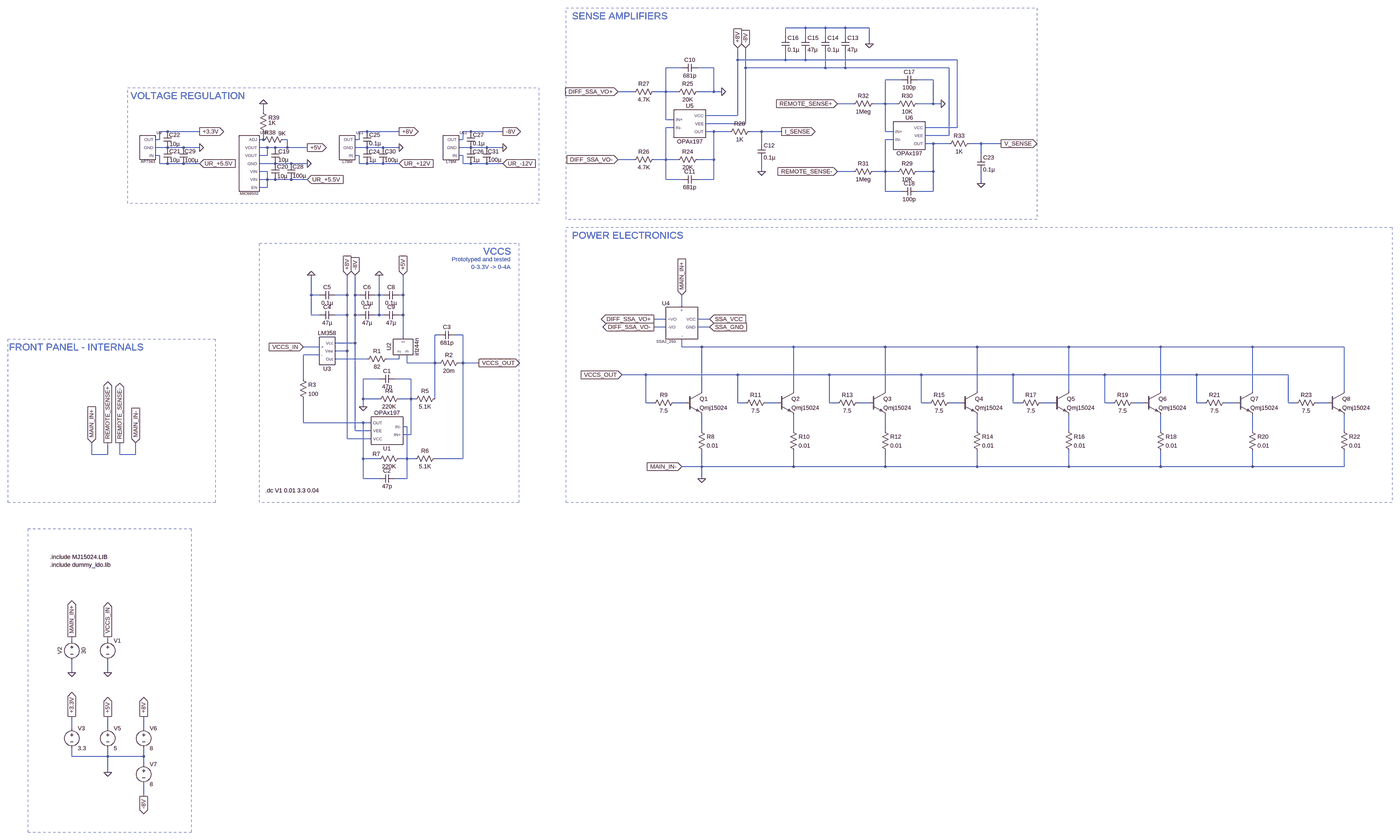
[diagram p0: schematic PDCL V1.asc, whole sheet]
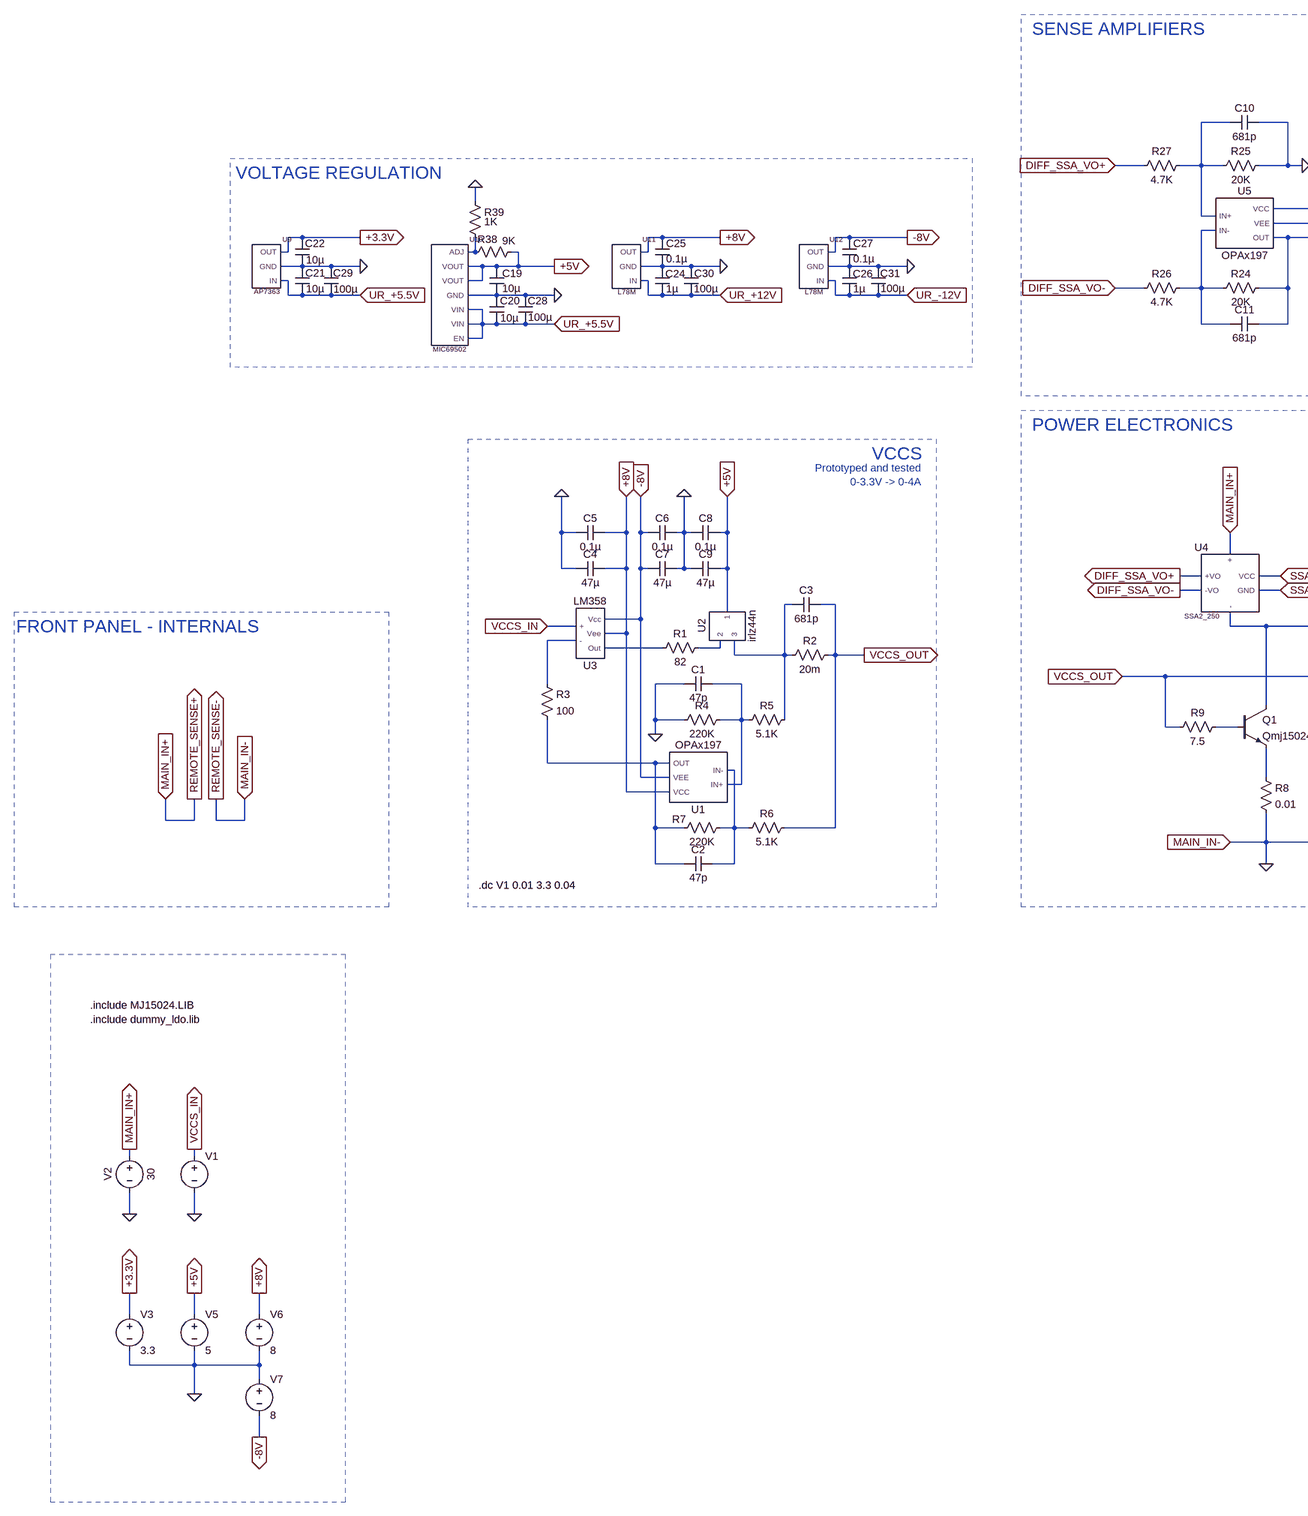
[diagram p1: schematic PDCL V1.asc, part, row 1 of 1, column 1 of 2]
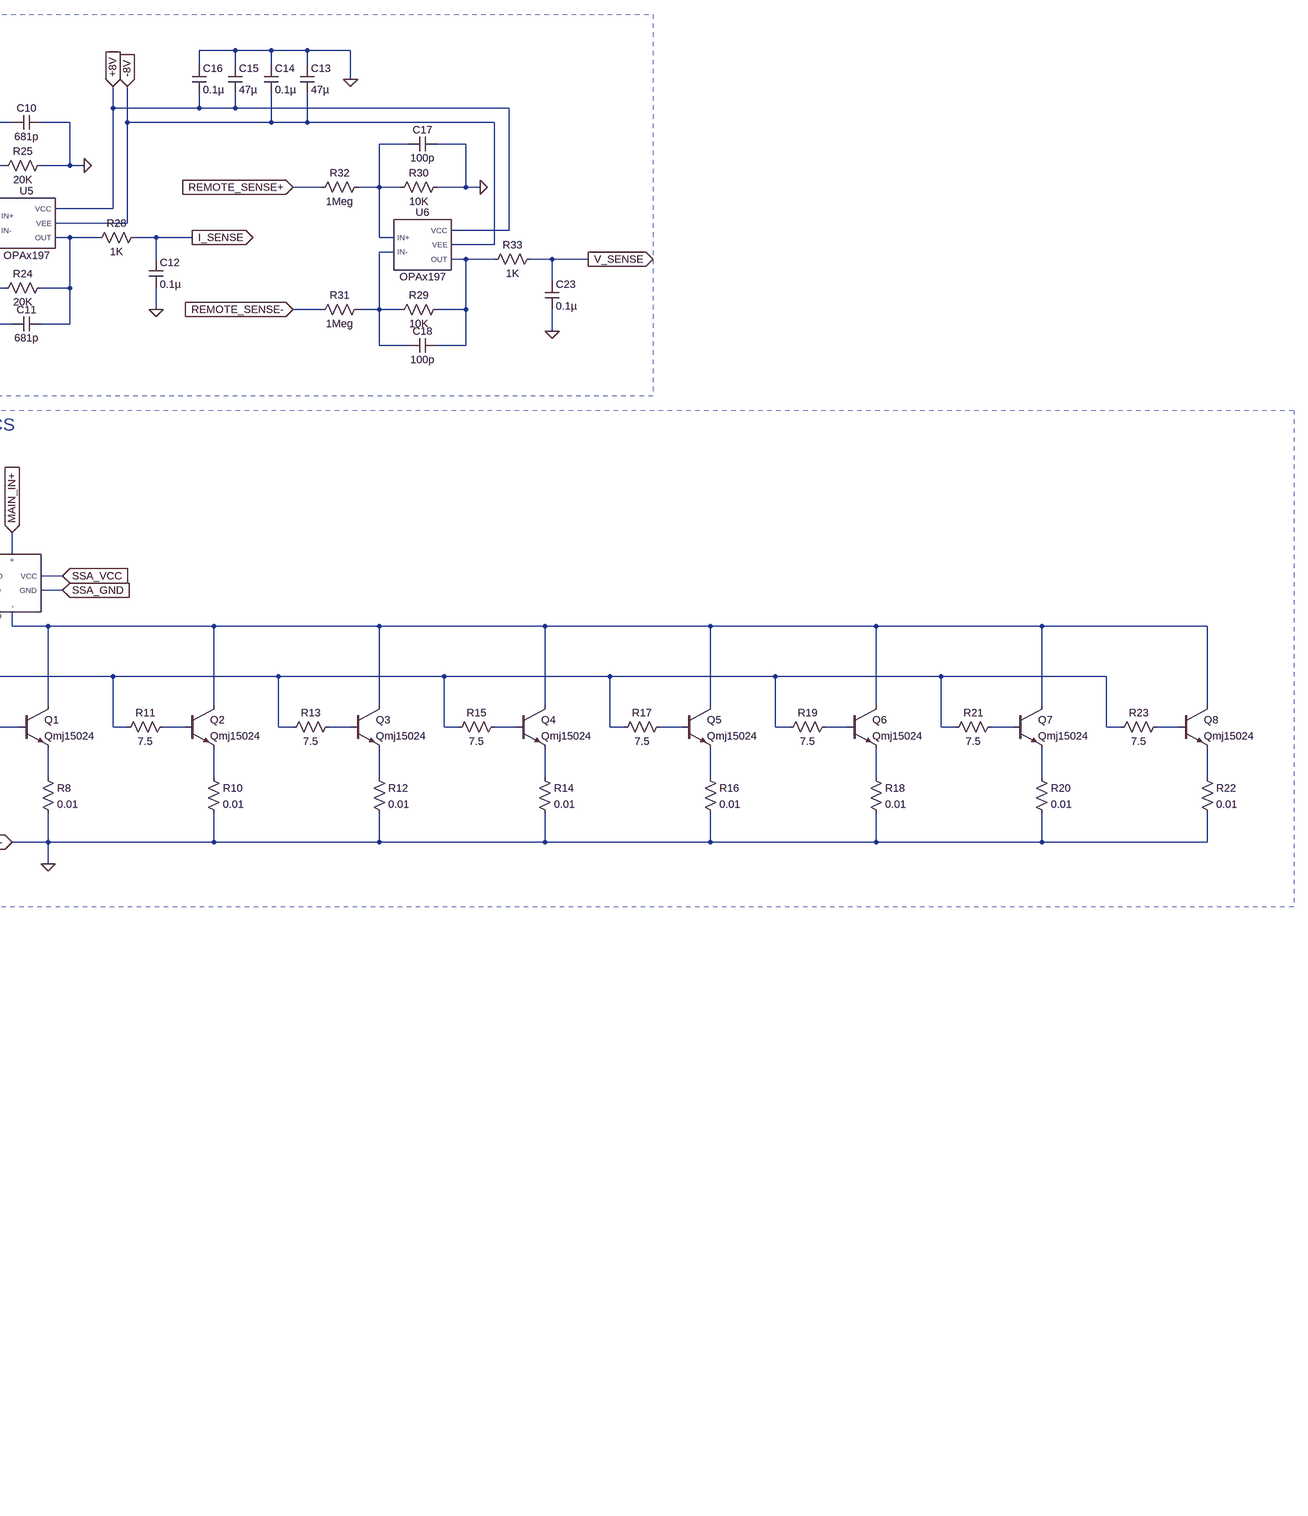
[diagram p2: schematic PDCL V1.asc, part, row 1 of 1, column 2 of 2]
PDCL V1.asc, the LTspice schematic file:
Version 4.1
SHEET 1 4852 2484
WIRE 2288 -1008 2208 -1008
WIRE 2368 -1008 2288 -1008
WIRE 2448 -1008 2368 -1008
WIRE 2544 -1008 2448 -1008
WIRE 2208 -976 2208 -1008
WIRE 2288 -976 2288 -1008
WIRE 2368 -976 2368 -1008
WIRE 2448 -976 2448 -1008
WIRE 2544 -944 2544 -1008
WIRE 2016 -880 2016 -928
WIRE 2208 -880 2208 -912
WIRE 2208 -880 2016 -880
WIRE 2288 -880 2288 -912
WIRE 2288 -880 2208 -880
WIRE 2896 -880 2288 -880
WIRE 1792 -848 1728 -848
WIRE 1920 -848 1856 -848
WIRE 2048 -848 2048 -928
WIRE 2368 -848 2368 -912
WIRE 2368 -848 2048 -848
WIRE 2448 -848 2448 -912
WIRE 2448 -848 2368 -848
WIRE 2864 -848 2448 -848
WIRE 2672 -800 2608 -800
WIRE 2800 -800 2736 -800
WIRE 1600 -752 1536 -752
WIRE 1728 -752 1728 -848
WIRE 1728 -752 1680 -752
WIRE 1776 -752 1728 -752
WIRE 1920 -752 1920 -848
WIRE 1920 -752 1856 -752
WIRE 1952 -752 1920 -752
WIRE 2480 -704 2416 -704
WIRE 2608 -704 2608 -800
WIRE 2608 -704 2560 -704
WIRE 2656 -704 2608 -704
WIRE 2800 -704 2800 -800
WIRE 2800 -704 2736 -704
WIRE 2832 -704 2800 -704
WIRE 96 -672 96 -704
WIRE 2016 -656 2016 -880
WIRE 2016 -656 1888 -656
WIRE 1728 -640 1728 -752
WIRE 1760 -640 1728 -640
WIRE 2048 -624 2048 -848
WIRE 2048 -624 1888 -624
WIRE 1760 -608 1728 -608
WIRE 2896 -608 2896 -880
WIRE 2896 -608 2768 -608
WIRE -288 -592 -320 -592
WIRE -160 -592 -288 -592
WIRE 512 -592 480 -592
WIRE 640 -592 512 -592
WIRE 928 -592 896 -592
WIRE 1056 -592 928 -592
WIRE 1920 -592 1888 -592
WIRE 1984 -592 1920 -592
WIRE 2112 -592 2064 -592
WIRE 2192 -592 2112 -592
WIRE 2608 -592 2608 -704
WIRE 2640 -592 2608 -592
WIRE 2864 -576 2864 -848
WIRE 2864 -576 2768 -576
WIRE -320 -560 -320 -592
WIRE -320 -560 -336 -560
WIRE 96 -560 96 -592
WIRE 96 -560 80 -560
WIRE 192 -560 176 -560
WIRE 480 -560 480 -592
WIRE 480 -560 464 -560
WIRE 896 -560 896 -592
WIRE 896 -560 880 -560
WIRE 2640 -560 2608 -560
WIRE 2112 -544 2112 -592
WIRE 2800 -544 2768 -544
WIRE 2864 -544 2800 -544
WIRE 2992 -544 2944 -544
WIRE 3072 -544 2992 -544
WIRE -288 -528 -336 -528
WIRE -224 -528 -288 -528
WIRE -160 -528 -224 -528
WIRE 112 -528 80 -528
WIRE 144 -528 112 -528
WIRE 192 -528 192 -560
WIRE 192 -528 144 -528
WIRE 272 -528 192 -528
WIRE 512 -528 464 -528
WIRE 576 -528 512 -528
WIRE 640 -528 576 -528
WIRE 928 -528 880 -528
WIRE 992 -528 928 -528
WIRE 1056 -528 992 -528
WIRE -320 -496 -336 -496
WIRE 112 -496 112 -528
WIRE 112 -496 80 -496
WIRE 480 -496 464 -496
WIRE 896 -496 880 -496
WIRE 2992 -496 2992 -544
WIRE 1600 -480 1536 -480
WIRE 1728 -480 1728 -608
WIRE 1728 -480 1680 -480
WIRE 1776 -480 1728 -480
WIRE 1920 -480 1920 -592
WIRE 1920 -480 1856 -480
WIRE -320 -464 -320 -496
WIRE -288 -464 -320 -464
WIRE -224 -464 -288 -464
WIRE -160 -464 -224 -464
WIRE 144 -464 80 -464
WIRE 208 -464 144 -464
WIRE 272 -464 208 -464
WIRE 480 -464 480 -496
WIRE 512 -464 480 -464
WIRE 576 -464 512 -464
WIRE 640 -464 576 -464
WIRE 896 -464 896 -496
WIRE 928 -464 896 -464
WIRE 992 -464 928 -464
WIRE 1056 -464 992 -464
WIRE 112 -432 80 -432
WIRE 2112 -432 2112 -480
WIRE 2480 -432 2416 -432
WIRE 2608 -432 2608 -560
WIRE 2608 -432 2560 -432
WIRE 2656 -432 2608 -432
WIRE 2800 -432 2800 -544
WIRE 2800 -432 2736 -432
WIRE 112 -400 112 -432
WIRE 112 -400 80 -400
WIRE 144 -400 112 -400
WIRE 208 -400 144 -400
WIRE 272 -400 208 -400
WIRE 1728 -400 1728 -480
WIRE 1792 -400 1728 -400
WIRE 1920 -400 1920 -480
WIRE 1920 -400 1856 -400
WIRE 2992 -384 2992 -432
WIRE 112 -368 112 -400
WIRE 112 -368 80 -368
WIRE 2608 -352 2608 -432
WIRE 2672 -352 2608 -352
WIRE 2800 -352 2800 -432
WIRE 2800 -352 2736 -352
WIRE 288 64 288 -16
WIRE 320 64 288 64
WIRE 432 64 432 -16
WIRE 432 64 384 64
WIRE 464 64 464 -16
WIRE 480 64 464 64
WIRE 560 64 560 -16
WIRE 560 64 544 64
WIRE 576 64 560 64
WIRE 656 64 656 -16
WIRE 656 64 640 64
WIRE 1792 112 1792 64
WIRE 288 144 288 64
WIRE 320 144 288 144
WIRE 432 144 432 64
WIRE 432 144 384 144
WIRE 464 144 464 64
WIRE 480 144 464 144
WIRE 560 144 560 64
WIRE 560 144 544 144
WIRE 576 144 560 144
WIRE 656 144 656 64
WIRE 656 144 640 144
WIRE 1728 160 1680 160
WIRE 1904 160 1856 160
WIRE 1728 192 1680 192
WIRE 1904 192 1856 192
WIRE 800 224 784 224
WIRE 896 224 864 224
WIRE 656 240 656 144
WIRE 464 256 464 144
WIRE 464 256 384 256
WIRE 320 272 256 272
WIRE 1792 272 1792 240
WIRE 1872 272 1792 272
WIRE 2240 272 1872 272
WIRE 2608 272 2240 272
WIRE 2976 272 2608 272
WIRE 3344 272 2976 272
WIRE 3712 272 3344 272
WIRE 4080 272 3712 272
WIRE 4448 272 4080 272
WIRE 432 288 432 144
WIRE 432 288 384 288
WIRE 320 304 256 304
WIRE 512 320 384 320
WIRE 640 320 640 304
WIRE 640 320 592 320
WIRE 672 336 672 304
WIRE 784 336 784 224
WIRE 784 336 672 336
WIRE 800 336 784 336
WIRE 896 336 896 224
WIRE 896 336 880 336
WIRE 960 336 896 336
WIRE 1648 384 1552 384
WIRE 2016 384 1648 384
WIRE 2384 384 2016 384
WIRE 2752 384 2384 384
WIRE 3120 384 2752 384
WIRE 3488 384 3120 384
WIRE 3856 384 3488 384
WIRE 4224 384 3856 384
WIRE 256 400 256 304
WIRE 560 400 496 400
WIRE 688 400 624 400
WIRE 1872 448 1872 272
WIRE 2240 448 2240 272
WIRE 2608 448 2608 272
WIRE 2976 448 2976 272
WIRE 3344 448 3344 272
WIRE 3712 448 3712 272
WIRE 4080 448 4080 272
WIRE 4448 448 4448 272
WIRE 496 480 496 400
WIRE 560 480 496 480
WIRE 688 480 688 400
WIRE 688 480 640 480
WIRE 704 480 688 480
WIRE 784 480 784 336
WIRE 1648 496 1648 384
WIRE 1680 496 1648 496
WIRE 1808 496 1760 496
WIRE 2016 496 2016 384
WIRE 2048 496 2016 496
WIRE 2176 496 2128 496
WIRE 2384 496 2384 384
WIRE 2416 496 2384 496
WIRE 2544 496 2496 496
WIRE 2752 496 2752 384
WIRE 2784 496 2752 496
WIRE 2912 496 2864 496
WIRE 3120 496 3120 384
WIRE 3152 496 3120 496
WIRE 3280 496 3232 496
WIRE 3488 496 3488 384
WIRE 3520 496 3488 496
WIRE 3648 496 3600 496
WIRE 3856 496 3856 384
WIRE 3888 496 3856 496
WIRE 4016 496 3968 496
WIRE 4224 496 4224 384
WIRE 4256 496 4224 496
WIRE 4384 496 4336 496
WIRE 496 512 496 480
WIRE 256 576 256 480
WIRE 496 576 256 576
WIRE 528 576 496 576
WIRE 672 592 656 592
WIRE 464 608 464 256
WIRE 528 608 464 608
WIRE 1872 608 1872 544
WIRE 2240 608 2240 544
WIRE 2608 608 2608 544
WIRE 2976 608 2976 544
WIRE 3344 608 3344 544
WIRE 3712 608 3712 544
WIRE 4080 608 4080 544
WIRE 4448 608 4448 544
WIRE 688 624 688 480
WIRE 688 624 656 624
WIRE 432 640 432 288
WIRE 528 640 432 640
WIRE -592 704 -592 656
WIRE -528 704 -528 656
WIRE -528 704 -592 704
WIRE -480 704 -480 656
WIRE -416 704 -416 656
WIRE -416 704 -480 704
WIRE 496 720 496 576
WIRE 560 720 496 720
WIRE 672 720 672 592
WIRE 672 720 640 720
WIRE 704 720 672 720
WIRE 896 720 896 336
WIRE 896 720 784 720
WIRE 1872 752 1872 688
WIRE 1872 752 1792 752
WIRE 2240 752 2240 688
WIRE 2240 752 1872 752
WIRE 2608 752 2608 688
WIRE 2608 752 2240 752
WIRE 2976 752 2976 688
WIRE 2976 752 2608 752
WIRE 3344 752 3344 688
WIRE 3344 752 2976 752
WIRE 3712 752 3712 688
WIRE 3712 752 3344 752
WIRE 4080 752 4080 688
WIRE 4080 752 3712 752
WIRE 4448 752 4448 688
WIRE 4448 752 4080 752
WIRE 496 800 496 720
WIRE 560 800 496 800
WIRE 672 800 672 720
WIRE 672 800 624 800
WIRE 1872 800 1872 752
WIRE -672 1712 -672 1696
WIRE -528 1712 -528 1696
WIRE -672 1840 -672 1792
WIRE -528 1840 -528 1792
WIRE -672 2064 -672 2016
WIRE -528 2064 -528 2016
WIRE -384 2064 -384 2016
WIRE -672 2176 -672 2144
WIRE -528 2176 -528 2144
WIRE -528 2176 -672 2176
WIRE -384 2176 -384 2144
WIRE -384 2176 -528 2176
WIRE -384 2208 -384 2176
WIRE -528 2240 -528 2176
WIRE -384 2336 -384 2288
FLAG 496 512 0
FLAG -528 1840 0
FLAG -528 2240 0
FLAG -528 2016 +5V
IOPIN -528 2016 Out
FLAG 656 -16 +5V
IOPIN 656 -16 In
FLAG -384 2016 +8V
IOPIN -384 2016 Out
FLAG -384 2336 -8V
IOPIN -384 2336 Out
FLAG 432 -16 +8V
IOPIN 432 -16 In
FLAG 464 -16 -8V
IOPIN 464 -16 In
FLAG 560 -16 0
FLAG 1552 384 VCCS_OUT
IOPIN 1552 384 In
FLAG 960 336 VCCS_OUT
IOPIN 960 336 Out
FLAG 1792 752 MAIN_IN-
IOPIN 1792 752 In
FLAG -672 1840 0
FLAG 288 -16 0
FLAG 1792 64 MAIN_IN+
IOPIN 1792 64 In
FLAG 1872 800 0
FLAG 1904 192 SSA_GND
IOPIN 1904 192 In
FLAG 1904 160 SSA_VCC
IOPIN 1904 160 In
FLAG 1680 160 DIFF_SSA_VO+
IOPIN 1680 160 Out
FLAG 1680 192 DIFF_SSA_VO-
IOPIN 1680 192 Out
FLAG -672 1696 MAIN_IN+
IOPIN -672 1696 Out
FLAG 1952 -752 0
FLAG 2112 -432 0
FLAG 1536 -752 DIFF_SSA_VO+
IOPIN 1536 -752 In
FLAG 1536 -480 DIFF_SSA_VO-
IOPIN 1536 -480 In
FLAG 2192 -592 I_SENSE
IOPIN 2192 -592 Out
FLAG 2832 -704 0
FLAG 2016 -928 +8V
IOPIN 2016 -928 In
FLAG 2048 -928 -8V
IOPIN 2048 -928 In
FLAG 2992 -384 0
FLAG 3072 -544 V_SENSE
IOPIN 3072 -544 Out
FLAG -592 656 MAIN_IN+
IOPIN -592 656 In
FLAG -528 656 REMOTE_SENSE+
IOPIN -528 656 Out
FLAG -480 656 REMOTE_SENSE-
IOPIN -480 656 Out
FLAG -416 656 MAIN_IN-
IOPIN -416 656 In
FLAG 2544 -944 0
FLAG -160 -592 +3.3V
IOPIN -160 -592 Out
FLAG 272 -528 +5V
IOPIN 272 -528 Out
FLAG -160 -464 UR_+5.5V
IOPIN -160 -464 In
FLAG 272 -400 UR_+5.5V
IOPIN 272 -400 In
FLAG 640 -464 UR_+12V
IOPIN 640 -464 In
FLAG 640 -592 +8V
IOPIN 640 -592 Out
FLAG 96 -704 0
FLAG 272 -464 0
FLAG -160 -528 0
FLAG 640 -528 0
FLAG 1056 -464 UR_-12V
IOPIN 1056 -464 In
FLAG 1056 -592 -8V
IOPIN 1056 -592 Out
FLAG 1056 -528 0
FLAG -672 2016 +3.3V
IOPIN -672 2016 Out
FLAG 2416 -704 REMOTE_SENSE+
IOPIN 2416 -704 In
FLAG 2416 -432 REMOTE_SENSE-
IOPIN 2416 -432 In
FLAG 256 272 VCCS_IN
IOPIN 256 272 In
FLAG -528 1696 VCCS_IN
IOPIN -528 1696 Out
SYMBOL res 896 320 R90
WINDOW 0 0 56 VBottom 2
WINDOW 3 32 56 VTop 2
SYMATTR InstName R2
SYMATTR Value 20m
SYMATTR SpiceLine tol=1 pwr=1 mfg="Vishay " pn="WSL2010R0200FEA18"
SYMBOL res 656 464 R90
WINDOW 0 0 56 VBottom 2
WINDOW 3 32 56 VTop 2
SYMATTR InstName R4
SYMATTR Value 220K
SYMATTR SpiceLine tol=0.1 pwr=0.125 mfg="Yageo" pn="RT0805BRD07220KL"
SYMBOL res 800 464 R90
WINDOW 0 0 56 VBottom 2
WINDOW 3 32 56 VTop 2
SYMATTR InstName R5
SYMATTR Value 5.1K
SYMATTR SpiceLine tol=0.1 pwr=0.1 mfg="Yageo" pn="RT0603BRD075K1L"
SYMBOL res 800 704 R90
WINDOW 0 0 56 VBottom 2
WINDOW 3 32 56 VTop 2
SYMATTR InstName R6
SYMATTR Value 5.1K
SYMATTR SpiceLine tol=0.1 pwr=0.1 mfg="Yageo" pn="RT0603BRD075K1L"
SYMBOL res 656 704 R90
WINDOW 0 13 107 VBottom 2
WINDOW 3 32 56 VTop 2
SYMATTR InstName R7
SYMATTR Value 220K
SYMATTR SpiceLine tol=0.1 pwr=0.125 mfg="Yageo" pn="RT0805BRD07220KL"
SYMBOL voltage -528 1696 R0
WINDOW 123 0 0 Left 0
WINDOW 39 0 0 Left 0
SYMATTR InstName V1
SYMATTR Value ""
SYMBOL voltage -528 2048 R0
WINDOW 123 0 0 Left 0
WINDOW 39 0 0 Left 0
SYMATTR InstName V5
SYMATTR Value 5
SYMBOL voltage -384 2048 R0
WINDOW 123 0 0 Left 0
WINDOW 39 0 0 Left 0
SYMATTR InstName V6
SYMATTR Value 8
SYMBOL voltage -384 2192 R0
WINDOW 123 0 0 Left 0
WINDOW 39 0 0 Left 0
SYMATTR InstName V7
SYMATTR Value 8
SYMBOL irlz44n 656 272 M90
SYMATTR InstName U2
SYMBOL OPAx197 592 608 R180
SYMATTR InstName U1
SYMBOL res 608 304 R90
WINDOW 0 0 56 VBottom 2
WINDOW 3 32 56 VTop 2
SYMATTR InstName R1
SYMATTR Value 82
SYMBOL cap 624 384 R90
WINDOW 0 0 32 VBottom 2
WINDOW 3 32 32 VTop 2
SYMATTR InstName C1
SYMATTR Value 47p
SYMATTR SpiceLine V=50 Irms=0 Rser=0 Lser=0 mfg="Murata" pn="GRM0335C1H470JA01" type="C0G"
SYMBOL cap 624 784 R90
WINDOW 0 0 32 VBottom 2
WINDOW 3 32 32 VTop 2
SYMATTR InstName C2
SYMATTR Value 47p
SYMATTR SpiceLine V=50 Irms=0 Rser=0 Lser=0 mfg="Murata" pn="GRM0335C1H470JA01" type="C0G"
SYMBOL cap 864 208 R90
WINDOW 0 0 32 VBottom 2
WINDOW 3 32 32 VTop 2
SYMATTR InstName C3
SYMATTR Value 681p
SYMATTR SpiceLine V=50 Irms=0 Rser=0.002 Lser=800p mfg="Murata" pn="GRM0335C1H681JE01D" type="C0G/NP0"
SYMBOL cap 384 128 R90
WINDOW 0 0 32 VBottom 2
WINDOW 3 32 32 VTop 2
SYMATTR InstName C4
SYMATTR Value 47µ
SYMATTR SpiceLine V=25 Irms=0 Rser=0 Lser=0 mfg="KEMET" pn="ESH476M025AC3AA" type="ESH"
SYMBOL cap 384 48 R90
WINDOW 0 0 32 VBottom 2
WINDOW 3 32 32 VTop 2
SYMATTR InstName C5
SYMATTR Value 0.1µ
SYMATTR SpiceLine V=50 Irms=0 Rser=0.01 Lser=1000p mfg="Samsung Electro-Mechanics" pn="CL10B104KB8NNNC" type="X7R"
SYMBOL cap 544 48 R90
WINDOW 0 0 32 VBottom 2
WINDOW 3 32 32 VTop 2
SYMATTR InstName C6
SYMATTR Value 0.1µ
SYMATTR SpiceLine V=50 Irms=0 Rser=0.01 Lser=1000p mfg="Samsung Electro-Mechanics" pn="CL10B104KB8NNNC" type="X7R"
SYMBOL cap 544 128 R90
WINDOW 0 0 32 VBottom 2
WINDOW 3 32 32 VTop 2
SYMATTR InstName C7
SYMATTR Value 47µ
SYMATTR SpiceLine V=25 Irms=0 Rser=0 Lser=0 mfg="KEMET" pn="ESH476M025AC3AA" type="ESH"
SYMBOL cap 640 48 R90
WINDOW 0 0 32 VBottom 2
WINDOW 3 32 32 VTop 2
SYMATTR InstName C8
SYMATTR Value 0.1µ
SYMATTR SpiceLine V=50 Irms=0 Rser=0.01 Lser=1000p mfg="Samsung Electro-Mechanics" pn="CL10B104KB8NNNC" type="X7R"
SYMBOL cap 640 128 R90
WINDOW 0 0 32 VBottom 2
WINDOW 3 32 32 VTop 2
SYMATTR InstName C9
SYMATTR Value 47µ
SYMATTR SpiceLine V=25 Irms=0 Rser=0 Lser=0 mfg="KEMET" pn="ESH476M025AC3AA" type="ESH"
SYMBOL res 240 384 R0
SYMATTR InstName R3
SYMATTR Value 100
SYMATTR SpiceLine tol=1 pwr=0.1 mfg="Yageo" pn="RC0603FR-07100RL"
SYMBOL LM358 352 288 M180
SYMATTR InstName U3
SYMBOL npn 1808 448 R0
SYMATTR InstName Q1
SYMATTR Value Qmj15024
SYMBOL res 1856 592 R0
SYMATTR InstName R8
SYMATTR Value 0.01
SYMBOL voltage -672 1696 R0
WINDOW 0 -32 56 VBottom 2
WINDOW 3 32 56 VTop 2
WINDOW 123 0 0 Left 0
WINDOW 39 0 0 Left 0
SYMATTR InstName V2
SYMATTR Value 30
SYMBOL res 1776 480 R90
WINDOW 0 0 56 VBottom 2
WINDOW 3 32 56 VTop 2
SYMATTR InstName R9
SYMATTR Value 7.5
SYMBOL npn 2176 448 R0
SYMATTR InstName Q2
SYMATTR Value Qmj15024
SYMBOL res 2224 592 R0
SYMATTR InstName R10
SYMATTR Value 0.01
SYMBOL res 2144 480 R90
WINDOW 0 0 56 VBottom 2
WINDOW 3 32 56 VTop 2
SYMATTR InstName R11
SYMATTR Value 7.5
SYMBOL npn 2544 448 R0
SYMATTR InstName Q3
SYMATTR Value Qmj15024
SYMBOL res 2592 592 R0
SYMATTR InstName R12
SYMATTR Value 0.01
SYMBOL res 2512 480 R90
WINDOW 0 0 56 VBottom 2
WINDOW 3 32 56 VTop 2
SYMATTR InstName R13
SYMATTR Value 7.5
SYMBOL npn 2912 448 R0
SYMATTR InstName Q4
SYMATTR Value Qmj15024
SYMBOL res 2960 592 R0
SYMATTR InstName R14
SYMATTR Value 0.01
SYMBOL res 2880 480 R90
WINDOW 0 0 56 VBottom 2
WINDOW 3 32 56 VTop 2
SYMATTR InstName R15
SYMATTR Value 7.5
SYMBOL npn 3280 448 R0
SYMATTR InstName Q5
SYMATTR Value Qmj15024
SYMBOL res 3328 592 R0
SYMATTR InstName R16
SYMATTR Value 0.01
SYMBOL res 3248 480 R90
WINDOW 0 0 56 VBottom 2
WINDOW 3 32 56 VTop 2
SYMATTR InstName R17
SYMATTR Value 7.5
SYMBOL npn 3648 448 R0
SYMATTR InstName Q6
SYMATTR Value Qmj15024
SYMBOL res 3696 592 R0
SYMATTR InstName R18
SYMATTR Value 0.01
SYMBOL res 3616 480 R90
WINDOW 0 0 56 VBottom 2
WINDOW 3 32 56 VTop 2
SYMATTR InstName R19
SYMATTR Value 7.5
SYMBOL npn 4016 448 R0
SYMATTR InstName Q7
SYMATTR Value Qmj15024
SYMBOL res 4064 592 R0
SYMATTR InstName R20
SYMATTR Value 0.01
SYMBOL res 3984 480 R90
WINDOW 0 0 56 VBottom 2
WINDOW 3 32 56 VTop 2
SYMATTR InstName R21
SYMATTR Value 7.5
SYMBOL npn 4384 448 R0
SYMATTR InstName Q8
SYMATTR Value Qmj15024
SYMBOL res 4432 592 R0
SYMATTR InstName R22
SYMATTR Value 0.01
SYMBOL res 4352 480 R90
WINDOW 0 0 56 VBottom 2
WINDOW 3 32 56 VTop 2
SYMATTR InstName R23
SYMATTR Value 7.5
SYMBOL SSA2_250 1776 192 R0
SYMATTR InstName U4
SYMBOL OPAx197 1824 -624 R0
SYMATTR InstName U5
SYMBOL res 1872 -496 R90
WINDOW 0 0 56 VBottom 2
WINDOW 3 32 56 VTop 2
SYMATTR InstName R24
SYMATTR Value 20K
SYMATTR SpiceLine tol=1 pwr=0.063 mfg="Yageo" pn="RC0402FR-0720KL"
SYMBOL res 1872 -768 R90
WINDOW 0 0 56 VBottom 2
WINDOW 3 32 56 VTop 2
SYMATTR InstName R25
SYMATTR Value 20K
SYMATTR SpiceLine tol=1 pwr=0.063 mfg="Yageo" pn="RC0402FR-0720KL"
SYMBOL res 1696 -496 R90
WINDOW 0 0 56 VBottom 2
WINDOW 3 32 56 VTop 2
SYMATTR InstName R26
SYMATTR Value 4.7K
SYMATTR SpiceLine tol=1 pwr=0.1 mfg="Yageo" pn="RC0603FR-074K7L"
SYMBOL res 1696 -768 R90
WINDOW 0 0 56 VBottom 2
WINDOW 3 32 56 VTop 2
SYMATTR InstName R27
SYMATTR Value 4.7K
SYMATTR SpiceLine tol=1 pwr=0.1 mfg="Yageo" pn="RC0603FR-074K7L"
SYMBOL cap 1856 -864 R90
WINDOW 0 0 32 VBottom 2
WINDOW 3 32 32 VTop 2
SYMATTR InstName C10
SYMATTR Value 681p
SYMATTR SpiceLine V=50 Irms=0 Rser=0.002 Lser=800p mfg="Murata" pn="GRM0335C1H681JE01D" type="C0G/NP0"
SYMBOL cap 1856 -416 R90
WINDOW 0 0 32 VBottom 2
WINDOW 3 32 32 VTop 2
SYMATTR InstName C11
SYMATTR Value 681p
SYMATTR SpiceLine V=50 Irms=0 Rser=0.002 Lser=800p mfg="Murata" pn="GRM0335C1H681JE01D" type="C0G/NP0"
SYMBOL res 2080 -608 R90
WINDOW 0 0 56 VBottom 2
WINDOW 3 32 56 VTop 2
SYMATTR InstName R28
SYMATTR Value 1K
SYMATTR SpiceLine tol=1 pwr=0.1 mfg="Yageo" pn="RC0603FR-071KL"
SYMBOL cap 2096 -544 R0
SYMATTR InstName C12
SYMATTR Value 0.1µ
SYMATTR SpiceLine V=50 Irms=0 Rser=0.01 Lser=1000p mfg="Samsung Electro-Mechanics" pn="CL10B104KB8NNNC" type="X7R"
SYMBOL OPAx197 2704 -576 R0
SYMATTR InstName U6
SYMBOL res 2752 -448 R90
WINDOW 0 0 56 VBottom 2
WINDOW 3 32 56 VTop 2
SYMATTR InstName R29
SYMATTR Value 10K
SYMATTR SpiceLine tol=0.5 pwr=0.125 mfg="Stackpole Electronics" pn="RNCF0805DTC10K0"
SYMBOL res 2752 -720 R90
WINDOW 0 0 56 VBottom 2
WINDOW 3 32 56 VTop 2
SYMATTR InstName R30
SYMATTR Value 10K
SYMATTR SpiceLine tol=0.5 pwr=0.125 mfg="Stackpole Electronics" pn="RNCF0805DTC10K0"
SYMBOL res 2576 -448 R90
WINDOW 0 0 56 VBottom 2
WINDOW 3 32 56 VTop 2
SYMATTR InstName R31
SYMATTR Value 1Meg
SYMATTR SpiceLine tol=1 pwr=0.1 mfg="Yageo" pn="RC0603FR-071ML"
SYMBOL res 2576 -720 R90
WINDOW 0 0 56 VBottom 2
WINDOW 3 32 56 VTop 2
SYMATTR InstName R32
SYMATTR Value 1Meg
SYMATTR SpiceLine tol=1 pwr=0.1 mfg="Yageo" pn="RC0603FR-071ML"
SYMBOL cap 2736 -816 R90
WINDOW 0 0 32 VBottom 2
WINDOW 3 32 32 VTop 2
SYMATTR InstName C17
SYMATTR Value 100p
SYMATTR SpiceLine V=50 Irms=0 Rser=0.1 Lser=500p mfg="Samsung Electro-Mechanics" pn="CL05C101JB5NNNC" type="C0G/NP0"
SYMBOL cap 2736 -368 R90
WINDOW 0 0 32 VBottom 2
WINDOW 3 32 32 VTop 2
SYMATTR InstName C18
SYMATTR Value 100p
SYMATTR SpiceLine V=50 Irms=0 Rser=0.1 Lser=500p mfg="Samsung Electro-Mechanics" pn="CL05C101JB5NNNC" type="C0G/NP0"
SYMBOL cap 2976 -496 R0
SYMATTR InstName C23
SYMATTR Value 0.1µ
SYMATTR SpiceLine V=50 Irms=0 Rser=0.01 Lser=1000p mfg="Samsung Electro-Mechanics" pn="CL10B104KB8NNNC" type="X7R"
SYMBOL res 2960 -560 R90
WINDOW 0 0 56 VBottom 2
WINDOW 3 32 56 VTop 2
SYMATTR InstName R33
SYMATTR Value 1K
SYMATTR SpiceLine tol=1 pwr=0.1 mfg="Yageo" pn="RC0603FR-071KL"
SYMBOL cap 2432 -976 R0
SYMATTR InstName C13
SYMATTR Value 47µ
SYMATTR SpiceLine V=25 Irms=0 Rser=0 Lser=0 mfg="KEMET" pn="ESH476M025AC3AA" type="ESH"
SYMBOL cap 2352 -976 R0
SYMATTR InstName C14
SYMATTR Value 0.1µ
SYMATTR SpiceLine V=50 Irms=0 Rser=0.01 Lser=1000p mfg="Samsung Electro-Mechanics" pn="CL10B104KB8NNNC" type="X7R"
SYMBOL cap 2272 -976 R0
SYMATTR InstName C15
SYMATTR Value 47µ
SYMATTR SpiceLine V=25 Irms=0 Rser=0 Lser=0 mfg="KEMET" pn="ESH476M025AC3AA" type="ESH"
SYMBOL cap 2192 -976 R0
SYMATTR InstName C16
SYMATTR Value 0.1µ
SYMATTR SpiceLine V=50 Irms=0 Rser=0.01 Lser=1000p mfg="Samsung Electro-Mechanics" pn="CL10B104KB8NNNC" type="X7R"
SYMBOL AP7363 -368 -512 R0
SYMATTR InstName U9
SYMBOL MIC69502 48 -432 R0
SYMATTR InstName U10
SYMBOL L78M 432 -496 R0
SYMATTR InstName U11
SYMBOL res 192 -576 R90
WINDOW 0 4 69 VBottom 2
WINDOW 3 -24 21 VTop 2
SYMATTR InstName R38
SYMATTR Value 9K
SYMBOL res 80 -688 R0
WINDOW 3 36 61 Left 2
SYMATTR Value 1K
SYMATTR InstName R39
SYMATTR SpiceLine tol=1 pwr=0.1 mfg="Yageo" pn="RC0603FR-071KL"
SYMBOL cap 128 -528 R0
WINDOW 0 28 16 Left 2
WINDOW 3 28 49 Left 2
SYMATTR InstName C19
SYMATTR Value 10µ
SYMATTR SpiceLine V=50 Irms=0 Rser=0 Lser=500p mfg="Samsung Electro-Mechanics" pn="CL31A106MBHNNNE" type="X5R"
SYMBOL cap 128 -464 R0
WINDOW 0 23 13 Left 2
WINDOW 3 24 51 Left 2
SYMATTR InstName C20
SYMATTR Value 10µ
SYMATTR SpiceLine V=50 Irms=0 Rser=0 Lser=500p mfg="Samsung Electro-Mechanics" pn="CL31A106MBHNNNE" type="X5R"
SYMBOL cap -304 -528 R0
WINDOW 0 23 15 Left 2
WINDOW 3 24 50 Left 2
SYMATTR InstName C21
SYMATTR Value 10µ
SYMATTR SpiceLine V=50 Irms=0 Rser=0 Lser=500p mfg="Samsung Electro-Mechanics" pn="CL31A106MBHNNNE" type="X5R"
SYMBOL cap -304 -592 R0
WINDOW 0 22 13 Left 2
WINDOW 3 24 50 Left 2
SYMATTR InstName C22
SYMATTR Value 10µ
SYMATTR SpiceLine V=50 Irms=0 Rser=0 Lser=500p mfg="Samsung Electro-Mechanics" pn="CL31A106MBHNNNE" type="X5R"
SYMBOL cap 496 -528 R0
WINDOW 0 23 17 Left 2
WINDOW 3 24 50 Left 2
SYMATTR InstName C24
SYMATTR Value 1µ
SYMATTR SpiceLine V=50 Irms=0 Rser=0 Lser=0 mfg="Samsung Electro-Mechanics" pn="CL21B105KBFNNNE" type="X7R"
SYMBOL cap 496 -592 R0
WINDOW 0 24 13 Left 2
WINDOW 3 24 47 Left 2
SYMATTR InstName C25
SYMATTR Value 0.1µ
SYMATTR SpiceLine V=50 Irms=0 Rser=0.01 Lser=1000p mfg="Samsung Electro-Mechanics" pn="CL10B104KB8NNNC" type="X7R"
SYMBOL L78M 848 -496 R0
SYMATTR InstName U12
SYMBOL cap 912 -528 R0
WINDOW 0 23 17 Left 2
WINDOW 3 24 50 Left 2
SYMATTR InstName C26
SYMATTR Value 1µ
SYMATTR SpiceLine V=50 Irms=0 Rser=0 Lser=0 mfg="Samsung Electro-Mechanics" pn="CL21B105KBFNNNE" type="X7R"
SYMBOL cap 912 -592 R0
WINDOW 0 24 13 Left 2
WINDOW 3 24 47 Left 2
SYMATTR InstName C27
SYMATTR Value 0.1µ
SYMATTR SpiceLine V=50 Irms=0 Rser=0.01 Lser=1000p mfg="Samsung Electro-Mechanics" pn="CL10B104KB8NNNC" type="X7R"
SYMBOL voltage -672 2048 R0
WINDOW 123 0 0 Left 0
WINDOW 39 0 0 Left 0
SYMATTR InstName V3
SYMATTR Value 3.3
SYMBOL cap 192 -464 R0
WINDOW 0 21 13 Left 2
WINDOW 3 22 49 Left 2
SYMATTR InstName C28
SYMATTR Value 100µ
SYMATTR SpiceLine V=25 Irms=0 Rser=0 Lser=0 mfg="KEMET" pn="ESK107M025AC3AA" type="ESK"
SYMBOL cap -240 -528 R0
WINDOW 0 20 15 Left 2
WINDOW 3 21 51 Left 2
SYMATTR InstName C29
SYMATTR Value 100µ
SYMATTR SpiceLine V=25 Irms=0 Rser=0 Lser=0 mfg="KEMET" pn="ESK107M025AC3AA" type="ESK"
SYMBOL cap 560 -528 R0
WINDOW 0 23 16 Left 2
WINDOW 3 22 50 Left 2
SYMATTR InstName C30
SYMATTR Value 100µ
SYMATTR SpiceLine V=25 Irms=0 Rser=0 Lser=0 mfg="KEMET" pn="ESK107M025AC3AA" type="ESK"
SYMBOL cap 976 -528 R0
WINDOW 0 20 16 Left 2
WINDOW 3 21 49 Left 2
SYMATTR InstName C31
SYMATTR Value 100µ
SYMATTR SpiceLine V=25 Irms=0 Rser=0 Lser=0 mfg="KEMET" pn="ESK107M025AC3AA" type="ESK"
TEXT 104 848 Left 2 !.dc V1 0.01 3.3 0.04
TEXT 1088 -112 Right 4 ;VCCS
TEXT 1088 -80 Right 2 ;Prototyped and tested\n0-3.3V -> 0-4A
TEXT -760 1376 Left 2 !.include MJ15024.LIB
TEXT 1352 -176 Left 4 ;POWER ELECTRONICS
TEXT 1352 -1056 Left 4 ;SENSE AMPLIFIERS
TEXT -760 1408 Left 2 !.include dummy_ldo.lib
TEXT -384 272 Right 4 ;FRONT PANEL - INTERNALS
TEXT 24 -736 Right 4 ;VOLTAGE REGULATION
RECTANGLE Normal 1120 896 80 -144 2
RECTANGLE Normal -848 2480 -192 1264 2
RECTANGLE Normal 4640 896 1328 -208 2
RECTANGLE Normal 3216 -240 1328 -1088 2
RECTANGLE Normal -96 896 -928 240 2
RECTANGLE Normal 1200 -304 -448 -768 2

The netlist it stands for:
* PDCL V1.asc
R2 VCCS_OUT N008 20m tol=1 pwr=1 mfg="Vishay " pn="WSL2010R0200FEA18"
R4 N013 0 220K tol=0.1 pwr=0.125 mfg="Yageo" pn="RT0805BRD07220KL"
R5 N008 N013 5.1K tol=0.1 pwr=0.1 mfg="Yageo" pn="RT0603BRD075K1L"
R6 VCCS_OUT N023 5.1K tol=0.1 pwr=0.1 mfg="Yageo" pn="RT0603BRD075K1L"
R7 N023 N022 220K tol=0.1 pwr=0.125 mfg="Yageo" pn="RT0805BRD07220KL"
V1 VCCS_IN 0
V5 +5V 0 5
V6 +8V 0 8
V7 0 -8V 8
X§U2 +5V N012 N008 irlz44n  ; pins 1 2 3
X§U1 N013 N023 +8V -8V N022 OPAx197  ; pins IN+ IN- VCC VEE OUT
R1 N012 N011 82
C1 N013 0 47p V=50 Irms=0 Rser=0 Lser=0 mfg="Murata" pn="GRM0335C1H470JA01" type="C0G"
C2 N023 N022 47p V=50 Irms=0 Rser=0 Lser=0 mfg="Murata" pn="GRM0335C1H470JA01" type="C0G"
C3 VCCS_OUT N008 681p V=50 Irms=0 Rser=0.002 Lser=800p mfg="Murata" pn="GRM0335C1H681JE01D" type="C0G/NP0"
C4 +8V 0 47µ V=25 Irms=0 Rser=0 Lser=0 mfg="KEMET" pn="ESH476M025AC3AA" type="ESH"
C5 +8V 0 0.1µ V=50 Irms=0 Rser=0.01 Lser=1000p mfg="Samsung Electro-Mechanics" pn="CL10B104KB8NNNC" type="X7R"
C6 0 -8V 0.1µ V=50 Irms=0 Rser=0.01 Lser=1000p mfg="Samsung Electro-Mechanics" pn="CL10B104KB8NNNC" type="X7R"
C7 0 -8V 47µ V=25 Irms=0 Rser=0 Lser=0 mfg="KEMET" pn="ESH476M025AC3AA" type="ESH"
C8 +5V 0 0.1µ V=50 Irms=0 Rser=0.01 Lser=1000p mfg="Samsung Electro-Mechanics" pn="CL10B104KB8NNNC" type="X7R"
C9 +5V 0 47µ V=25 Irms=0 Rser=0 Lser=0 mfg="KEMET" pn="ESH476M025AC3AA" type="ESH"
R3 N010 N022 100 tol=1 pwr=0.1 mfg="Yageo" pn="RC0603FR-07100RL"
X§U3 N010 VCCS_IN N011 +8V -8V LM358  ; pins - + Out Vee Vcc
Q1 N009 N014 N024 0 Qmj15024
R8 N024 0 0.01
V2 REMOTE_SENSE+ 0 30
R9 N014 VCCS_OUT 7.5
Q2 N009 N015 N025 0 Qmj15024
R10 N025 0 0.01
R11 N015 VCCS_OUT 7.5
Q3 N009 N016 N026 0 Qmj15024
R12 N026 0 0.01
R13 N016 VCCS_OUT 7.5
Q4 N009 N017 N027 0 Qmj15024
R14 N027 0 0.01
R15 N017 VCCS_OUT 7.5
Q5 N009 N018 N028 0 Qmj15024
R16 N028 0 0.01
R17 N018 VCCS_OUT 7.5
Q6 N009 N019 N029 0 Qmj15024
R18 N029 0 0.01
R19 N019 VCCS_OUT 7.5
Q7 N009 N020 N030 0 Qmj15024
R20 N030 0 0.01
R21 N020 VCCS_OUT 7.5
Q8 N009 N021 N031 0 Qmj15024
R22 N031 0 0.01
R23 N021 VCCS_OUT 7.5
X§U4 REMOTE_SENSE+ N009 DIFF_SSA_VO+ DIFF_SSA_VO- SSA_VCC SSA_GND SSA2_250  ; pins + - +VO -VO VCC GND
X§U5 N001 N003 +8V -8V N004 OPAx197  ; pins IN+ IN- VCC VEE OUT
R24 N004 N003 20K tol=1 pwr=0.063 mfg="Yageo" pn="RC0402FR-0720KL"
R25 0 N001 20K tol=1 pwr=0.063 mfg="Yageo" pn="RC0402FR-0720KL"
R26 N003 DIFF_SSA_VO- 4.7K tol=1 pwr=0.1 mfg="Yageo" pn="RC0603FR-074K7L"
R27 N001 DIFF_SSA_VO+ 4.7K tol=1 pwr=0.1 mfg="Yageo" pn="RC0603FR-074K7L"
C10 0 N001 681p V=50 Irms=0 Rser=0.002 Lser=800p mfg="Murata" pn="GRM0335C1H681JE01D" type="C0G/NP0"
C11 N004 N003 681p V=50 Irms=0 Rser=0.002 Lser=800p mfg="Murata" pn="GRM0335C1H681JE01D" type="C0G/NP0"
R28 I_SENSE N004 1K tol=1 pwr=0.1 mfg="Yageo" pn="RC0603FR-071KL"
C12 I_SENSE 0 0.1µ V=50 Irms=0 Rser=0.01 Lser=1000p mfg="Samsung Electro-Mechanics" pn="CL10B104KB8NNNC" type="X7R"
X§U6 N002 N006 +8V -8V N007 OPAx197  ; pins IN+ IN- VCC VEE OUT
R29 N007 N006 10K tol=0.5 pwr=0.125 mfg="Stackpole Electronics" pn="RNCF0805DTC10K0"
R30 0 N002 10K tol=0.5 pwr=0.125 mfg="Stackpole Electronics" pn="RNCF0805DTC10K0"
R31 N006 0 1Meg tol=1 pwr=0.1 mfg="Yageo" pn="RC0603FR-071ML"
R32 N002 REMOTE_SENSE+ 1Meg tol=1 pwr=0.1 mfg="Yageo" pn="RC0603FR-071ML"
C17 0 N002 100p V=50 Irms=0 Rser=0.1 Lser=500p mfg="Samsung Electro-Mechanics" pn="CL05C101JB5NNNC" type="C0G/NP0"
C18 N007 N006 100p V=50 Irms=0 Rser=0.1 Lser=500p mfg="Samsung Electro-Mechanics" pn="CL05C101JB5NNNC" type="C0G/NP0"
C23 V_SENSE 0 0.1µ V=50 Irms=0 Rser=0.01 Lser=1000p mfg="Samsung Electro-Mechanics" pn="CL10B104KB8NNNC" type="X7R"
R33 V_SENSE N007 1K tol=1 pwr=0.1 mfg="Yageo" pn="RC0603FR-071KL"
C13 0 -8V 47µ V=25 Irms=0 Rser=0 Lser=0 mfg="KEMET" pn="ESH476M025AC3AA" type="ESH"
C14 0 -8V 0.1µ V=50 Irms=0 Rser=0.01 Lser=1000p mfg="Samsung Electro-Mechanics" pn="CL10B104KB8NNNC" type="X7R"
C15 0 +8V 47µ V=25 Irms=0 Rser=0 Lser=0 mfg="KEMET" pn="ESH476M025AC3AA" type="ESH"
C16 0 +8V 0.1µ V=50 Irms=0 Rser=0.01 Lser=1000p mfg="Samsung Electro-Mechanics" pn="CL10B104KB8NNNC" type="X7R"
X§U9 UR_+5.5V 0 +3.3V AP7363  ; pins IN GND OUT
X§U10 UR_+5.5V UR_+5.5V UR_+5.5V 0 +5V +5V N005 MIC69502  ; pins EN VIN VIN GND VOUT VOUT ADJ
X§U11 UR_+12V 0 +8V L78M  ; pins IN GND OUT
R38 +5V N005 9K
R39 0 N005 1K tol=1 pwr=0.1 mfg="Yageo" pn="RC0603FR-071KL"
C19 +5V 0 10µ V=50 Irms=0 Rser=0 Lser=500p mfg="Samsung Electro-Mechanics" pn="CL31A106MBHNNNE" type="X5R"
C20 0 UR_+5.5V 10µ V=50 Irms=0 Rser=0 Lser=500p mfg="Samsung Electro-Mechanics" pn="CL31A106MBHNNNE" type="X5R"
C21 0 UR_+5.5V 10µ V=50 Irms=0 Rser=0 Lser=500p mfg="Samsung Electro-Mechanics" pn="CL31A106MBHNNNE" type="X5R"
C22 +3.3V 0 10µ V=50 Irms=0 Rser=0 Lser=500p mfg="Samsung Electro-Mechanics" pn="CL31A106MBHNNNE" type="X5R"
C24 0 UR_+12V 1µ V=50 Irms=0 Rser=0 Lser=0 mfg="Samsung Electro-Mechanics" pn="CL21B105KBFNNNE" type="X7R"
C25 +8V 0 0.1µ V=50 Irms=0 Rser=0.01 Lser=1000p mfg="Samsung Electro-Mechanics" pn="CL10B104KB8NNNC" type="X7R"
X§U12 UR_-12V 0 -8V L78M  ; pins IN GND OUT
C26 0 UR_-12V 1µ V=50 Irms=0 Rser=0 Lser=0 mfg="Samsung Electro-Mechanics" pn="CL21B105KBFNNNE" type="X7R"
C27 -8V 0 0.1µ V=50 Irms=0 Rser=0.01 Lser=1000p mfg="Samsung Electro-Mechanics" pn="CL10B104KB8NNNC" type="X7R"
V3 +3.3V 0 3.3
C28 0 UR_+5.5V 100µ V=25 Irms=0 Rser=0 Lser=0 mfg="KEMET" pn="ESK107M025AC3AA" type="ESK"
C29 0 UR_+5.5V 100µ V=25 Irms=0 Rser=0 Lser=0 mfg="KEMET" pn="ESK107M025AC3AA" type="ESK"
C30 0 UR_+12V 100µ V=25 Irms=0 Rser=0 Lser=0 mfg="KEMET" pn="ESK107M025AC3AA" type="ESK"
C31 0 UR_-12V 100µ V=25 Irms=0 Rser=0 Lser=0 mfg="KEMET" pn="ESK107M025AC3AA" type="ESK"
.model NPN NPN
.model PNP PNP
.lib standard.bjt
.dc V1 0.01 3.3 0.04
* VCCS
* Prototyped and tested
* 0-3.3V -> 0-4A
.include MJ15024.LIB
* POWER ELECTRONICS
* SENSE AMPLIFIERS
.include dummy_ldo.lib
* FRONT PANEL - INTERNALS
* VOLTAGE REGULATION
.lib Y:\Projects\Programmable_Electronic_Load\LTSpice\Test Setups\VCCS V2\irlz44n.spi
.lib Y:\Projects\Programmable_Electronic_Load\LTSpice\Test Setups\VCCS V2\OPAx197.LIB
.lib Y:\Projects\Programmable_Electronic_Load\LTSpice\Test Setups\VCCS V2\lm358.txt
.lib Y:\Projects\Programmable_Electronic_Load\LTSpice\V1\SSA2_CUSTOM.lib
.backanno
.end

* Results of the author's LTspice run, read from the files saved beside the schematic
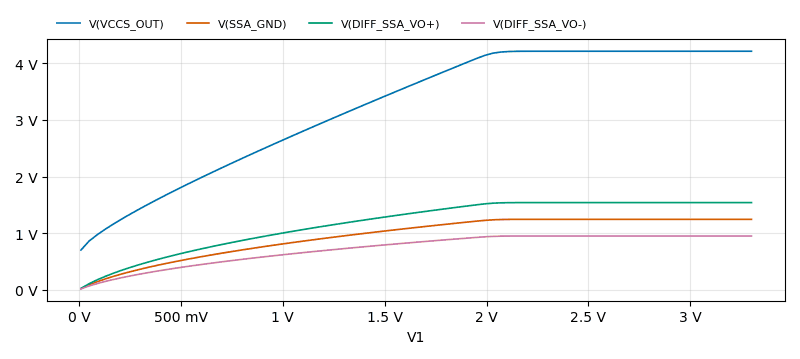
[diagram p3: DC transfer characteristic of PDCL V1.asc, plotted from the saved traces]
* DC transfer characteristic, 1 run:
*   V(VCCS_OUT): 699.7 mV at V1=10 mV, 4.216 V at V1=3.3 V, min 699.7 mV, max 4.216 V
*   V(SSA_GND): 17.21 mV at V1=10 mV, 1.242 V at V1=3.3 V, min 17.21 mV, max 1.242 V
*   V(DIFF_SSA_VO+): 21.3 mV at V1=10 mV, 1.539 V at V1=3.3 V, min 21.3 mV, max 1.539 V
*   V(DIFF_SSA_VO-): 13.13 mV at V1=10 mV, 947.4 mV at V1=3.3 V, min 13.13 mV, max 947.4 mV